# Altium schematic sheet РЕЛЕ.SchDoc
size A4; Organization: Altium Limited; Address1: L3, 12a Rodborough Rd; Address2: Frenchs Forest; Address3: NSW; Address4: Australia 2086
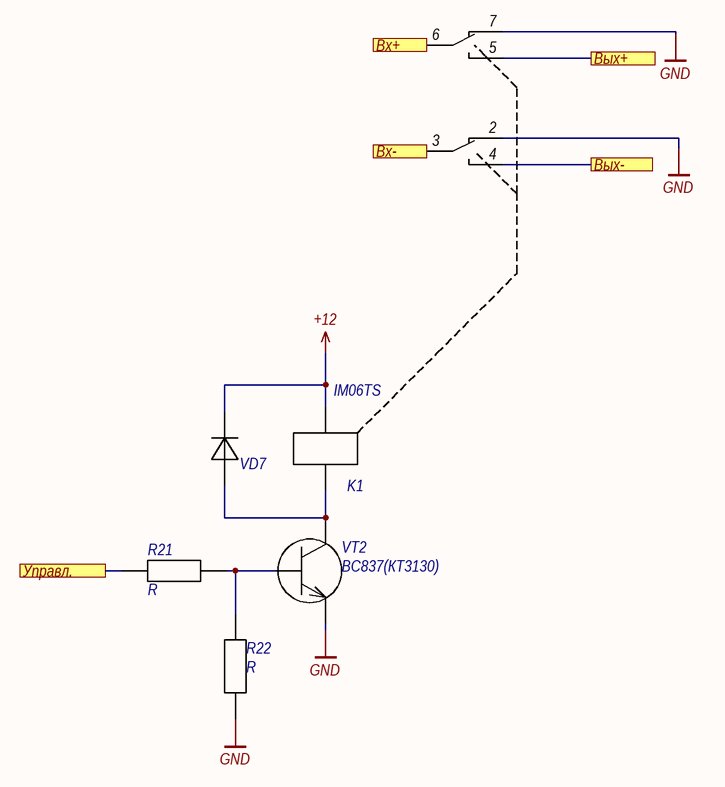
[diagram p0: РЕЛЕ.SchDoc]

## Parts
K1  IM06TS  [IM06TS]
R21  R  [R]
R22  R  [R]
VD7  SS14  [SS14]  (value not drawn)
VT2  BC837(КТ3130)  [BC847(IRLML6402)]

## Ports
Вх+, Вх-, Вых+, Вых-, Управл.

## Nets
+12: K1.1 VD7.1
GND: K1.2 K1.7 R22.1 VT2.2
Вх+: K1.6 ; port Вх+
Вх-: K1.3 ; port Вх-
Вых+: K1.5 ; port Вых+
Вых-: K1.4 ; port Вых-
Управл.: R21.1 ; port Управл.
NetK1_8: K1.8 VD7.2 VT2.3
NetR21_2: R21.2 R22.2 VT2.1

## Notes on the sheet
- Title
- Size:
- Date:
- A4
- Number:
- Time:
- Revision:
- Sheet
- of
- File: